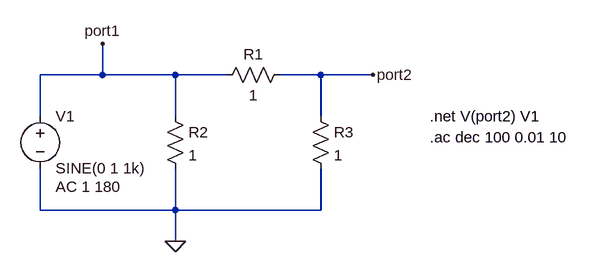
[diagram p0: schematic circuito.asc]
circuito.asc, the LTspice schematic file:
Version 4.1
SHEET 1 880 680
WIRE 112 64 112 16
WIRE 112 64 16 64
WIRE 224 64 112 64
WIRE 304 64 224 64
WIRE 448 64 384 64
WIRE 528 64 448 64
WIRE 16 128 16 64
WIRE 224 128 224 64
WIRE 448 128 448 64
WIRE 16 272 16 208
WIRE 224 272 224 208
WIRE 224 272 16 272
WIRE 448 272 448 208
WIRE 448 272 224 272
WIRE 224 320 224 272
FLAG 224 320 0
FLAG 112 16 port1
FLAG 528 64 port2
SYMBOL voltage 16 112 R0
WINDOW 123 24 124 Left 2
WINDOW 39 0 0 Left 0
SYMATTR InstName V1
SYMATTR Value SINE(0 1 1k)
SYMATTR Value2 AC 1 180
SYMBOL res 400 48 R90
WINDOW 0 0 56 VBottom 2
WINDOW 3 32 56 VTop 2
SYMATTR InstName R1
SYMATTR Value 1
SYMBOL res 208 112 R0
SYMATTR InstName R2
SYMATTR Value 1
SYMBOL res 432 112 R0
SYMATTR InstName R3
SYMATTR Value 1
TEXT 616 128 Left 2 !.net V(port2) V1
TEXT 616 160 Left 2 !.ac dec 100 0.01 10

The netlist it stands for:
* circuito.asc
V1 port1 0 SINE(0 1 1k) AC 1 180
R1 port2 port1 1
R2 port1 0 1
R3 port2 0 1
.net V(port2) V1
.ac dec 100 0.01 10
.backanno
.end